# Altium schematic sheet MCU.SchDoc
size A4
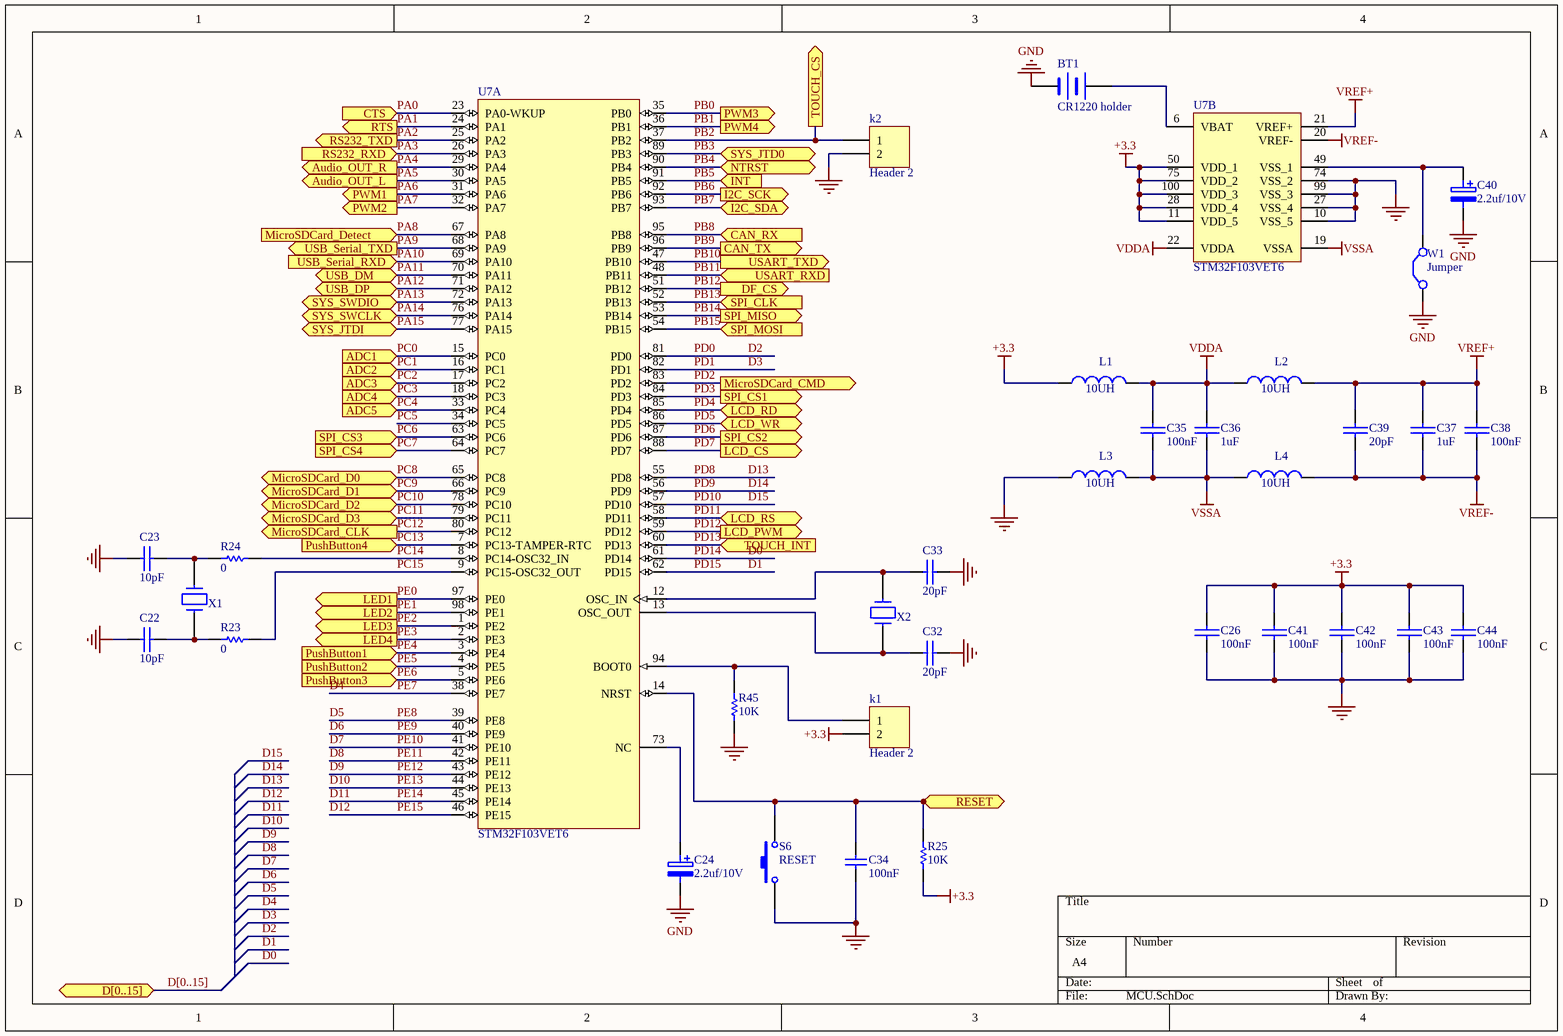
[diagram p0: MCU.SchDoc]

## Parts
BT1  CR1220 holder  [BAT]
C22  10pF  [1206]
C23  10pF  [1206]
C24  2.2uf/10V  [1210]
C26  100nF  [0805]
C32  20pF  [1206]
C33  20pF  [1206]
C34  100nF  [1206]
C35  100nF  [1206]
C36  1uF  [1206]
C37  1uF  [1206]
C38  100nF  [1206]
C39  20pF  [1206]
C40  2.2uf/10V  [1210]
C41  100nF  [0805]
C42  100nF  [0805]
C43  100nF  [0805]
C44  100nF  [0805]
k1  Header 2  [SIP2]
k2  Header 2  [SIP2]
L1  10UH  [L1206]
L2  10UH  [L1206]
L3  10UH  [L1206]
L4  10UH  [L1206]
R23  0  [R1206]
R24  0  [R1206]
R25  10K  [R1206]
R45  10K  [1206]
S6  RESET  [SWSMD]
U7  STM32F103VET6  [STM-LQFP100_N]  (parts A,B of 2)
W1  Jumper  [JP2_SMD]
X1  HC-49S-C16QSA-8M(jfvny)(with socket)  [Xtal1]  (value not drawn)
X2  HC-49S-C16QSA-8M(jfvny)(with socket)  [XTAL3]  (value not drawn)

## Ports
ADC1 (in), ADC2 (in), ADC3 (in), ADC4 (in), ADC5 (in), Audio_OUT_L (out), Audio_OUT_R (out), CAN_RX (in), CAN_TX (out), CTS (in), D[0..15] (bidir), DF_CS (out), I2C_SCK (out), I2C_SDA (bidir), INT (in), LCD_CS (out), LCD_PWM (out), LCD_RD (bidir), LCD_RS (bidir), LCD_WR (bidir), LED1 (out), LED2 (out), LED3 (out), LED4 (out), MicroSDCard_CLK (out), MicroSDCard_CMD (out), MicroSDCard_D0 (bidir), MicroSDCard_D1 (bidir), MicroSDCard_D2 (bidir), MicroSDCard_D3 (bidir), MicroSDCard_Detect (in), NTRST (bidir), PushButton1 (in), PushButton2 (in), PushButton3 (in), PushButton4 (in), PWM1 (out), PWM2 (out), PWM3 (out), PWM4 (out), RESET (bidir), RS232_RXD (in), RS232_TXD (out), RTS (out), SPI_CLK (in), SPI_CS1 (out), SPI_CS2 (out), SPI_CS3 (in), SPI_CS4 (in), SPI_MISO (out), SPI_MOSI (in), SYS_JTD0 (bidir), SYS_JTDI (bidir), SYS_SWCLK (bidir), SYS_SWDIO (bidir), TOUCH_CS (out), TOUCH_INT (in), USART_RXD (in), USART_TXD (out), USB_DM (bidir), USB_DP (bidir), USB_Serial_RXD (in), USB_Serial_TXD (out)

## Nets
+3.3: C26.2 C41.2 C42.2 C43.2 C44.2 k1.2 L1.1 R25.1 U7.11(VDD_5) U7.28(VDD_4) U7.50(VDD_1) U7.75(VDD_2) U7.100(VDD_3)
GND: BT1.2(-) C22.2 C23.2 C24.2 C26.1 C32.2 C33.2 C34.1 C40.2 C41.1 C42.1 C43.1 C44.1 k2.2 L3.1 R45.1 S6.1 U7.10(VSS_5) U7.27(VSS_4) U7.74(VSS_2) U7.99(VSS_3) W1.1(C1)
VDDA: C35.2 C36.2 L1.2 L2.1 U7.22(VDDA)
VREF+: C37.2 C38.2 C39.2 L2.2 U7.21(VREF+)
VREF-: C37.1 C38.1 C39.1 L4.2 U7.20(VREF-)
VSSA: C35.1 C36.1 L3.2 L4.1 U7.19(VSSA)
D0: U7.61(PD14)  [also labelled PD14]
D1: U7.62(PD15)  [also labelled PD15]
D2: U7.81(PD0)  [also labelled PD0]
D3: U7.82(PD1)  [also labelled PD1]
D4: U7.38(PE7)  [also labelled PE7]
D5: U7.39(PE8)  [also labelled PE8]
D6: U7.40(PE9)  [also labelled PE9]
D7: U7.41(PE10)  [also labelled PE10]
D8: U7.42(PE11)  [also labelled PE11]
D9: U7.43(PE12)  [also labelled PE12]
D10: U7.44(PE13)  [also labelled PE13]
D11: U7.45(PE14)  [also labelled PE14]
D12: U7.46(PE15)  [also labelled PE15]
D13: U7.55(PD8)  [also labelled PD8]
D14: U7.56(PD9)  [also labelled PD9]
D15: U7.57(PD10)  [also labelled PD10]
PA0: U7.23(PA0-WKUP) ; port CTS
PA1: U7.24(PA1) ; port RTS
PA2: U7.25(PA2) ; port RS232_TXD
PA3: U7.26(PA3) ; port RS232_RXD
PA4: U7.29(PA4) ; port Audio_OUT_R
PA5: U7.30(PA5) ; port Audio_OUT_L
PA6: U7.31(PA6) ; port PWM1
PA7: U7.32(PA7) ; port PWM2
PA8: U7.67(PA8) ; port MicroSDCard_Detect
PA9: U7.68(PA9) ; port USB_Serial_TXD
PA10: U7.69(PA10) ; port USB_Serial_RXD
PA11: U7.70(PA11) ; port USB_DM
PA12: U7.71(PA12) ; port USB_DP
PA13: U7.72(PA13) ; port SYS_SWDIO
PA14: U7.76(PA14) ; port SYS_SWCLK
PA15: U7.77(PA15) ; port SYS_JTDI
PB0: U7.35(PB0) ; port PWM3
PB1: U7.36(PB1) ; port PWM4
PB2: k2.1 U7.37(PB2) ; port TOUCH_CS
PB3: U7.89(PB3) ; port SYS_JTD0
PB4: U7.90(PB4) ; port NTRST
PB5: U7.91(PB5) ; port INT
PB6: U7.92(PB6) ; port I2C_SCK
PB7: U7.93(PB7) ; port I2C_SDA
PB8: U7.95(PB8) ; port CAN_RX
PB9: U7.96(PB9) ; port CAN_TX
PB10: U7.47(PB10) ; port USART_TXD
PB11: U7.48(PB11) ; port USART_RXD
PB12: U7.51(PB12) ; port DF_CS
PB13: U7.52(PB13) ; port SPI_CLK
PB14: U7.53(PB14) ; port SPI_MISO
PB15: U7.54(PB15) ; port SPI_MOSI
PC0: U7.15(PC0) ; port ADC1
PC1: U7.16(PC1) ; port ADC2
PC2: U7.17(PC2) ; port ADC3
PC3: U7.18(PC3) ; port ADC4
PC4: U7.33(PC4) ; port ADC5
PC5: U7.34(PC5)
PC6: U7.63(PC6) ; port SPI_CS3
PC7: U7.64(PC7) ; port SPI_CS4
PC8: U7.65(PC8) ; port MicroSDCard_D0
PC9: U7.66(PC9) ; port MicroSDCard_D1
PC10: U7.78(PC10) ; port MicroSDCard_D2
PC11: U7.79(PC11) ; port MicroSDCard_D3
PC12: U7.80(PC12) ; port MicroSDCard_CLK
PC13: U7.7(PC13-TAMPER-RTC) ; port PushButton4
PC14: R24.2 U7.8(PC14-OSC32_IN)
PC15: R23.2 U7.9(PC15-OSC32_OUT)
PD2: U7.83(PD2) ; port MicroSDCard_CMD
PD3: U7.84(PD3) ; port SPI_CS1
PD4: U7.85(PD4) ; port LCD_RD
PD5: U7.86(PD5) ; port LCD_WR
PD6: U7.87(PD6) ; port SPI_CS2
PD7: U7.88(PD7) ; port LCD_CS
PD11: U7.58(PD11) ; port LCD_RS
PD12: U7.59(PD12) ; port LCD_PWM
PD13: U7.60(PD13) ; port TOUCH_INT
PE0: U7.97(PE0) ; port LED1
PE1: U7.98(PE1) ; port LED2
PE2: U7.1(PE2) ; port LED3
PE3: U7.2(PE3) ; port LED4
PE4: U7.3(PE4) ; port PushButton1
PE5: U7.4(PE5) ; port PushButton2
PE6: U7.5(PE6) ; port PushButton3
RESET: C34.2 R25.2 S6.2 U7.14(NRST) ; port RESET
NetBT1_1: BT1.1(+) U7.6(VBAT)
NetC22_1: C22.1 R23.1 X1.2
NetC23_1: C23.1 R24.1 X1.1
NetC24_1: C24.1 U7.73(NC)
NetC32_1: C32.1 U7.13(OSC_OUT) X2.2
NetC33_1: C33.1 U7.12(OSC_IN) X2.1
NetC40_1: C40.1 U7.49(VSS_1) W1.2(C2)
Netk1_1: k1.1 R45.2 U7.94(BOOT0)

## Buses and harness runs
bus D[0..15] = port D[0..15]

## Library data of the parts
BT1 = BATTERY
C22 C23 C26 C32 C33 C35-C39 C41-C44 = CAP: Capacitor
C24 C40 = ELECTRO2: Electrolytic Capacitor
C34 = CAP: Capacitor; Value: 100pF; Published: 8-Jun-2000; Revision: July-2002: Re-released for DXP Platform.; Publisher: Altium Limited
k1 k2 = Header 2: Header, 2-Pin; LatestRevisionDate: 17-Jul-2002; LatestRevisionNote: Re-released for DXP Platform.; Publisher: Altium Limited
L1-L4 = Inductor: Value: 100uH; Published: 8-Jun-2000; Revision: July-2002: Re-released for DXP Platform.; Publisher: Altium Limited
R23 R24 = Res1: Resistor; Value: 1K; Published: 8-Jun-2000; Revision: July-2002: Re-released for DXP Platform.; Publisher: Altium Limited
R25 R45 = res1: Resistor; Value: 1K; Published: 8-Jun-2000; Revision: July-2002: Re-released for DXP Platform.; Publisher: Altium Limited
S6 = SW-PB: Switch; Published: 24-Mar-1999; LatestRevisionDate: 17-Jul-2002; LatestRevisionNote: Re-released for DXP Platform.; PackageReference: SPST-2; Publisher: Altium Limited
U7 = STM32F103VET6: ARM Cortex-M3 32-bit MCU, 512 KB Flash, 64 KB Internal RAM, 80 I/Os, 100-pin LQFP, -40 to 85 degC, Tray; A/D Converter: 3x12-bit (16 Channel); D/A Converter: 2x12-bit (2 Channel); FLASH Size (Prog) (kB): 512; I/Os (High Current): 80; Internal RAM Size (kB): 64; Operating Frequency(F) (Processor speed) (MHz): 72; Supply Voltage(Vcc) min (V): 2; DatasheetVersion: Rev. 8; PackageVersion: Rev. 1, 06/2013; PackageReference: LQFP100; PackageDescription: 100-Pin Low Profile Quad Flat Package, 14 x 14 mm Body, 0.5 mm Pitch; Supplier 1: Digi-Key; Supplier Part Number 1: 497-6443-ND; Supplier 2: Farnell; Supplier Part Number 2: 1624141; Supplier 3: Newark; Supplier Part Number 3: 01P4104; Supplier 4: Newark; Supplier Part Number 4: 57P1260; Supplier 5: Mouser; Supplier Part Number 5: 511-STM32F103VET6; Core: ARM Cortex-M3; Packing: Tray; Mounting Technology: Surface Mount; PartNumber: STM32F103VET6; ComponentLink1Description: Manufacturer URL; ComponentLink1URL: http://www.st.com/web/en/home.html; ComponentLink2Description: Datasheet; ComponentLink2URL: http://www.st.com/st-web-ui/static/active/en/resource/technical/document/datasheet/CD00191185.pdf; ComponentLink3Description: Package Specification; ComponentLink3URL: http://www.st.com/st-web-ui/static/active/en/resource/technical/document/data_brief/DM00071938.pdf
W1 = Jumper: Jumper Wire; Published: 24-Mar-1999; LatestRevisionDate: 17-Jul-2002; LatestRevisionNote: Re-released for DXP Platform.; PackageReference: RAD-0.2; Publisher: Altium Limited
X1 X2 = CRYSTAL